# Altium schematic sheet USB_Connectors.SchDoc
size A3; PageSetup: Record=PageOptions|CenterHorizontal=True|CenterVertical=True|PrintScale=0.71|XCorrection=1.00|YCorrection=1.00|PrintKind=0|BorderSize=5000000|LeftOffset=0|BottomOffset=0|Orientation=2|PaperLength=1000|PaperWidth=1000|Scale=100|PaperSource=7|PrintQuality=-4|MediaType=1|DitherType=10|PaperKind=A4|PrintScaleMode=1; Date: 27.05.2014; DrawnBy: luths8; Organization: BFH; Address1: Bern University of Applied Sciences; Address2: Engineering and Information Technology; Address3: Jlcoweg 1; Address4: CH-3400 Burgdorf; DocumentNumber: 6; Revision: 1.1; SheetNumber: 6; SheetTotal: 16; CurrentDate: 27.05.2014
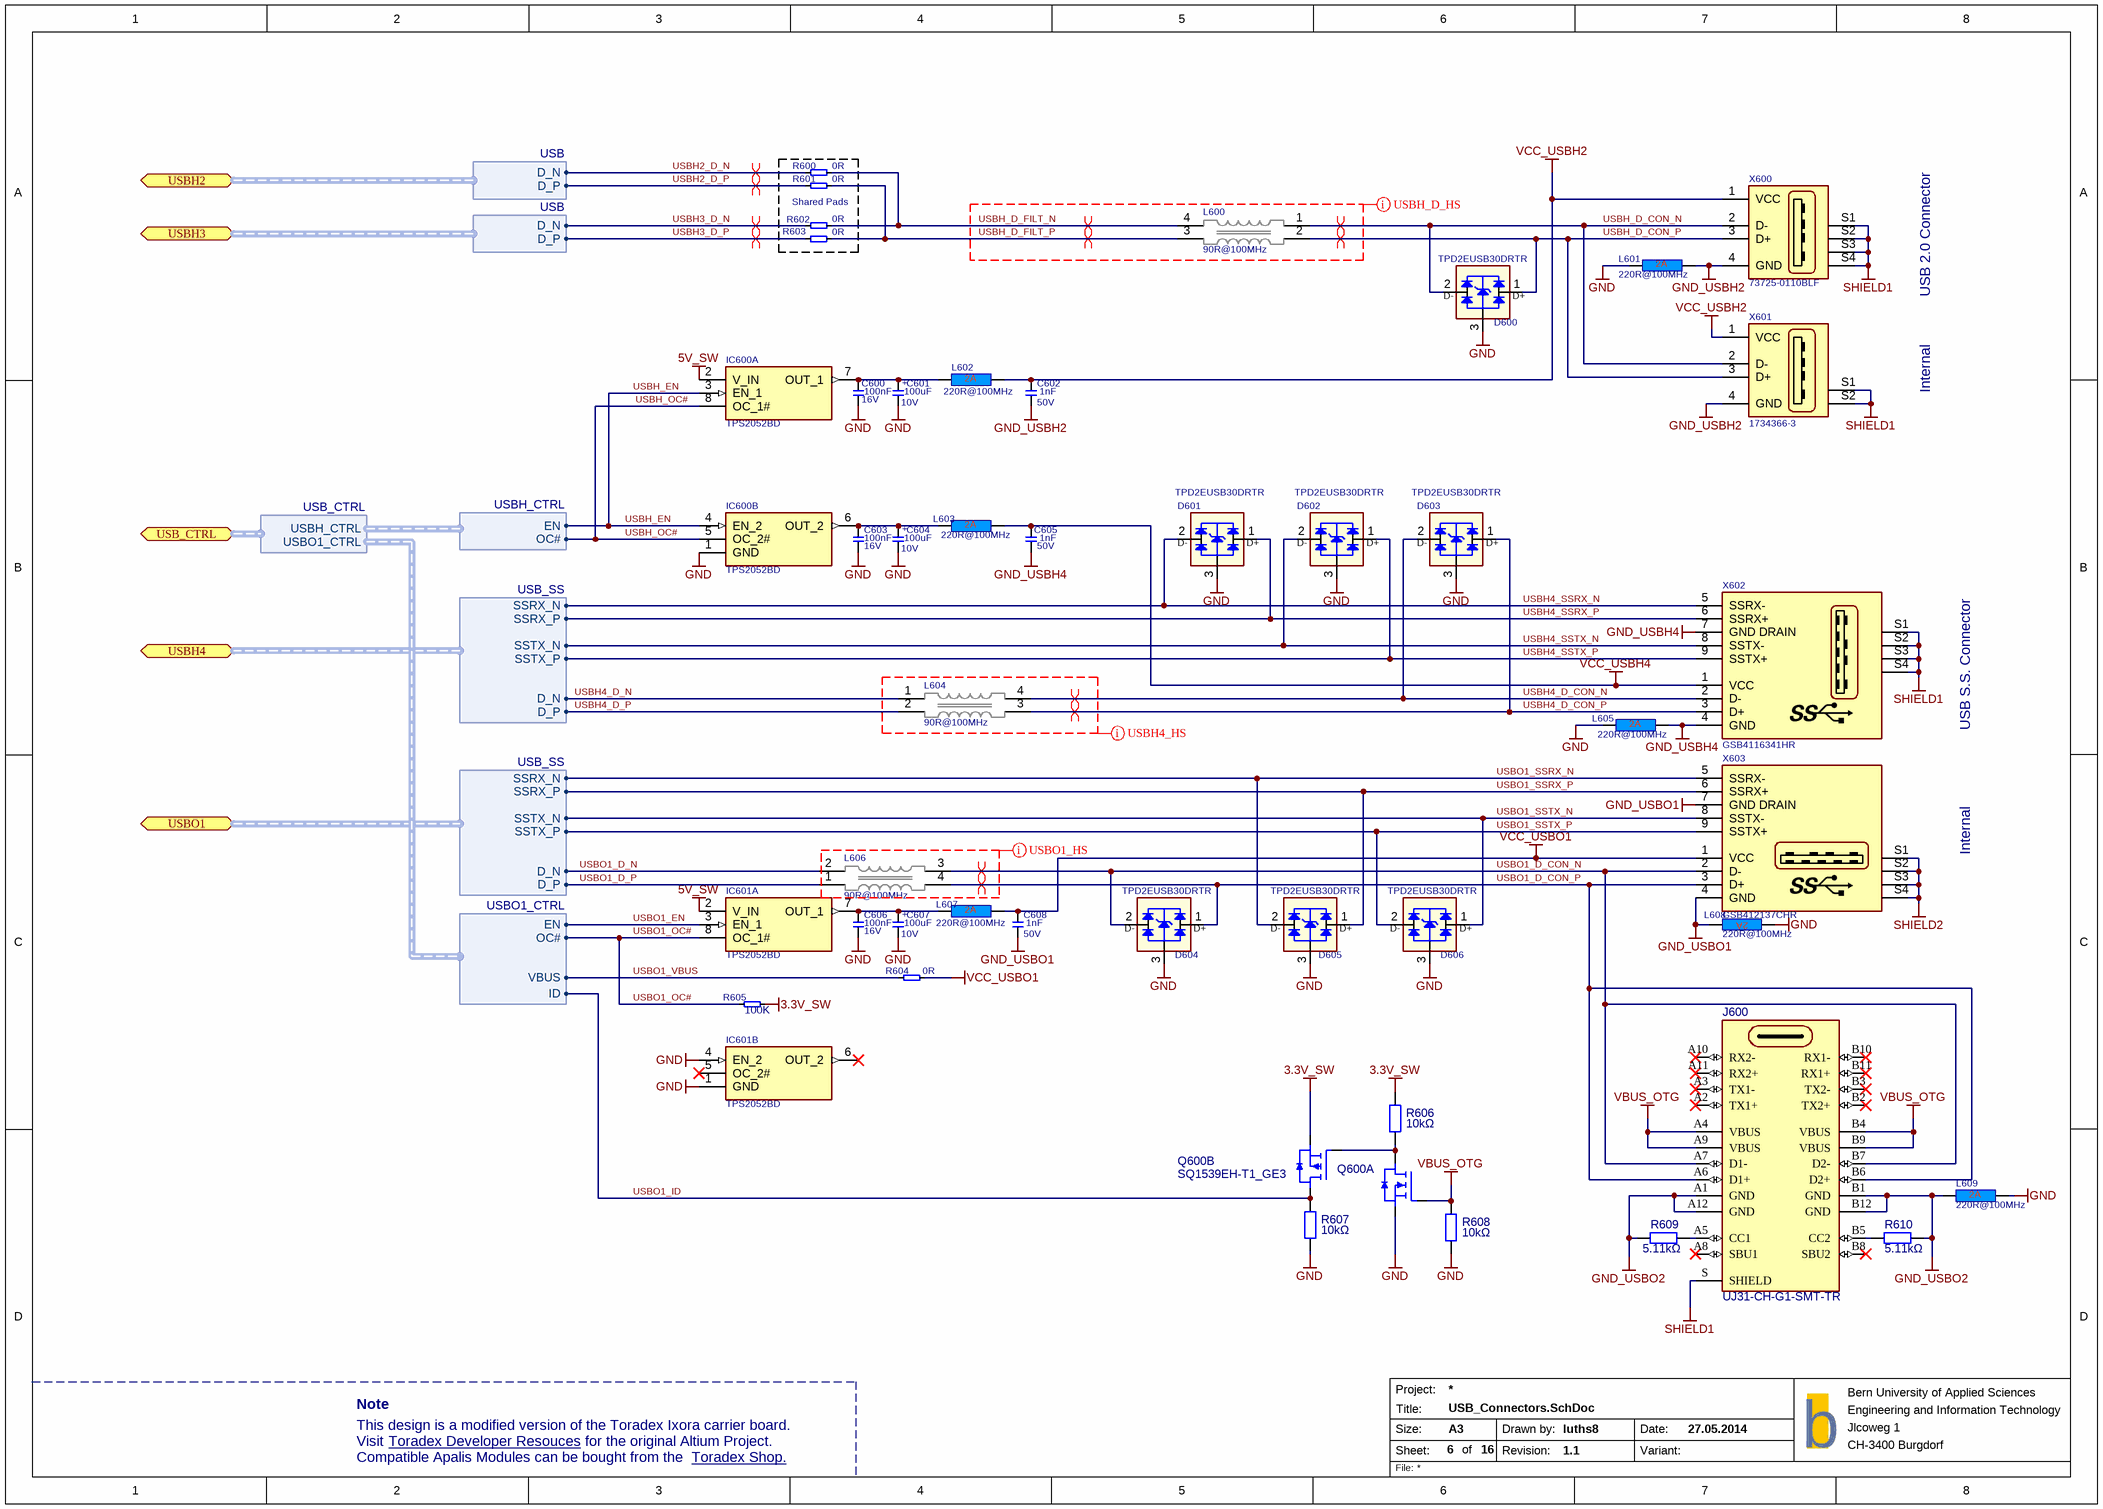
[diagram p0: USB_Connectors.SchDoc]

## Parts
C600  Rating: 16V  [SMD0603CAP]  (hidden comment: 100nF)
C601  Rating: 10V  [CAPMP6032X280N]  (hidden comment: 100uF)
C602  Rating: 50V  [SMD0603CAP]  (hidden comment: 1nF)
C603  Rating: 16V  [SMD0603CAP]  (hidden comment: 100nF)
C604  Rating: 10V  [CAPMP6032X280N]  (hidden comment: 100uF)
C605  Rating: 50V  [SMD0603CAP]  (hidden comment: 1nF)
C606  Rating: 16V  [SMD0603CAP]  (hidden comment: 100nF)
C607  Rating: 10V  [CAPMP6032X280N]  (hidden comment: 100uF)
C608  Rating: 50V  [SMD0603CAP]  (hidden comment: 1nF)
D600  TPD2EUSB30DRTR  [T_TI_TPD2EUSB30DRTR]
D601  TPD2EUSB30DRTR  [T_TI_TPD2EUSB30DRTR]
D602  TPD2EUSB30DRTR  [T_TI_TPD2EUSB30DRTR]
D603  TPD2EUSB30DRTR  [T_TI_TPD2EUSB30DRTR]
D604  TPD2EUSB30DRTR  [T_TI_TPD2EUSB30DRTR]
D605  TPD2EUSB30DRTR  [T_TI_TPD2EUSB30DRTR]
D606  TPD2EUSB30DRTR  [T_TI_TPD2EUSB30DRTR]
IC600  TPS2052BD  [SOIC127P600X173-8N]  (parts A,B of 2)
IC601  TPS2052BD  [SOIC127P600X173-8N]  (parts A,B of 2)
J600  UJ31-CH-G1-SMT-TR  [UJ31-CH-G1-SMT-TR]
L600  90R@100MHz  [T_Murata_DLW21SN900SQ2]
L601  220R@100MHz  [INDC1608X95N]
L602  220R@100MHz  [INDC1608X95N]
L603  220R@100MHz  [INDC1608X95N]
L604  90R@100MHz  [T_Murata_DLW21SN900SQ2]
L605  220R@100MHz  [INDC1608X95N]
L606  90R@100MHz  [T_Murata_DLW21SN900SQ2]
L607  220R@100MHz  [INDC1608X95N]
L608  220R@100MHz  [INDC1608X95N]
L609  220R@100MHz  [INDC1608X95N]
Q600  SQ1539EH-T1_GE3  [SOT-363-6]  (value not drawn)  (parts A,B of 2)
R600  0R  [SMD0603RES]
R601  0R  [SMD0603RES]
R602  0R  [SMD0603RES]
R603  0R  [SMD0603RES]
R604  0R  [SMD0603RES]
R605  100K  [SMD0603RES]
R606  10kΩ  [SMD0603RES]
R607  10kΩ  [SMD0603RES]
R608  10kΩ  [SMD0603RES]
R609  5.11kΩ  [SMD0603RES]
R610  5.11kΩ  [SMD0603RES]
X600  Manufacturer Part No.: 73725-0110BLF  [T_FCI_73725-0110BLF]  (hidden comment: CON-Fci-73725-0110BLF)
X601  CON-TE-1734366-3  [1734366-3]  (value not drawn)
X602  GSB4116341HR  [GSB4116341HR]
X603  GSB412137CHR  [GSB412137CHR]

## Blocks framed on the sheet
Shared Pads: R600-R603

## Ports
USB_CTRL (bidir, harness USB_CTRL), USBH2 (bidir, harness USB), USBH3 (bidir, harness USB), USBH4 (bidir, harness USB_SS), USBO1 (bidir, harness USB_SS)

## Harnesses
USB_SS: D_N, D_P, SSTX_N, SSTX_P, SSRX_N, SSRX_P
USBO1_CTRL: VBUS, ID, OC#, EN
USBH_CTRL: OC#, EN
USB_CTRL: USBO1_CTRL, USBH_CTRL
USB: D_N, D_P

## Nets
3.3V_SW: Q600.4(S) R605.2 R606.2
5V_SW: IC600.2(V_IN) IC601.2(V_IN)
GND: C600.1 C601.2 C603.1 C604.2 C606.1 C607.2 D600.3 D601.3 D602.3 D603.3 D604.3 D605.3 D606.3 IC600.1(GND) IC601.1(GND) IC601.4(EN_2) L601.1 L605.1 L608.1 L609.1 Q600.1(S) R607.1 R608.1
GND_USBH2: C602.1 L601.2 X600.4(GND) X601.4(GND)
GND_USBH4: C605.1 L605.2 X602.4(GND) X602.7(GND_DRAIN)
GND_USBO1: C608.1 L608.2 X603.4(GND) X603.7(GND_DRAIN)
GND_USBO2: J600.A1(GND) J600.A12(GND) J600.B1(GND) J600.B12(GND) L609.2 R609.1 R610.1
SHIELD1: J600.S(SHIELD) X600.S1 X600.S2 X600.S3 X600.S4 X601.S1 X601.S2 X602.S1 X602.S2 X602.S3 X602.S4
SHIELD2: X603.S1 X603.S2 X603.S3 X603.S4
VBUS_OTG: J600.A4(VBUS) J600.A9(VBUS) J600.B4(VBUS) J600.B9(VBUS) Q600.2(G) R608.2
VCC_USBH2: C602.2 L602.2 X600.1(VCC) X601.1(VCC)
VCC_USBH4: C605.2 L603.2 X602.1(VCC)
VCC_USBO1: C608.2 L607.2 R604.2 X603.1(VCC)
USBH2_D_N: R600.1 ; port USBH2.D_N
USBH2_D_P: R601.1 ; port USBH2.D_P
USBH3_D_N: R602.1 ; port USBH3.D_N
USBH3_D_P: R603.1 ; port USBH3.D_P
USBH4_D_CON_N: D603.2(D-) L604.4 X602.2(D-)
USBH4_D_CON_P: D603.1(D+) L604.3 X602.3(D+)
USBH4_D_N: L604.1 ; port USBH4.D_N
USBH4_D_P: L604.2 ; port USBH4.D_P
USBH4_SSRX_N: D601.2(D-) X602.5(SSRX-) ; port USBH4.SSRX_N
USBH4_SSRX_P: D601.1(D+) X602.6(SSRX+) ; port USBH4.SSRX_P
USBH4_SSTX_N: D602.2(D-) X602.8(SSTX-) ; port USBH4.SSTX_N
USBH4_SSTX_P: D602.1(D+) X602.9(SSTX+) ; port USBH4.SSTX_P
USBH_D_CON_N: D600.2(D-) L600.1 X600.2(D-) X601.2(D-)
USBH_D_CON_P: D600.1(D+) L600.2 X600.3(D+) X601.3(D+)
USBH_D_FILT_N: L600.4 R600.2 R602.2
USBH_D_FILT_P: L600.3 R601.2 R603.2
USBH_EN: IC600.3(EN_1) IC600.4(EN_2) ; harness USBH_CTRL.EN
USBH_OC#: IC600.5(OC_2#) IC600.8(OC_1#) ; harness USBH_CTRL.OC#
USBO1_D_CON_N: D604.2(D-) J600.A7(D1-) J600.B7(D2-) L606.3 X603.2(D-)
USBO1_D_CON_P: D604.1(D+) J600.A6(D1+) J600.B6(D2+) L606.4 X603.3(D+)
USBO1_D_N: L606.2 ; port USBO1.D_N
USBO1_D_P: L606.1 ; port USBO1.D_P
USBO1_EN: IC601.3(EN_1) ; harness USBO1_CTRL.EN
USBO1_ID: Q600.3(D) R607.2 ; harness USBO1_CTRL.ID
USBO1_OC#: IC601.8(OC_1#) R605.1 ; harness USBO1_CTRL.OC#
USBO1_SSRX_N: D605.2(D-) X603.5(SSRX-) ; port USBO1.SSRX_N
USBO1_SSRX_P: D605.1(D+) X603.6(SSRX+) ; port USBO1.SSRX_P
USBO1_SSTX_N: D606.1(D+) X603.8(SSTX-) ; port USBO1.SSTX_N
USBO1_SSTX_P: D606.2(D-) X603.9(SSTX+) ; port USBO1.SSTX_P
USBO1_VBUS: R604.1 ; harness USBO1_CTRL.VBUS
NetC600_2: C600.2 C601.1 IC600.7(OUT_1) L602.1
NetC603_2: C603.2 C604.1 IC600.6(OUT_2) L603.1
NetC606_2: C606.2 C607.1 IC601.7(OUT_1) L607.1
NetJ600_A5: J600.A5(CC1) R609.2
NetJ600_B5: J600.B5(CC2) R610.2
NetQ600_5: Q600.5(G) Q600.6(D) R606.1

Not connected (* = marked no-connect by the designer): IC601 5(OC_2#)* 6(OUT_2)*; J600 A2(TX1+)* A3(TX1-)* A8(SBU1)* A10(RX2-)* A11(RX2+)* B2(TX2+)* B3(TX2-)* B8(SBU2)* B10(RX1-)* B11(RX1+)*

## Layout directives
differential pair: USBH2_D_N, USBH2_D_P, USBH3_D_N, USBH3_D_P, USBH4_D_CON_N, USBH4_D_CON_P, USBH_D_CON_N, USBH_D_CON_P, USBH_D_FILT_N, USBH_D_FILT_P, USBO1_D_CON_N, USBO1_D_CON_P
net class USBO1_HS: (no net found under the mark)
net class USBH4_HS: (no net found under the mark)
net class USBH_D_HS: USBH_D_FILT_N, USBH_D_FILT_P

## Notes on the sheet
- USB 2.0 Connector
- Internal
- USB S.S. Connector
- Note
- This design is a modified version of the Toradex Ixora carrier board.
- Visit
- Compatible Apalis Modules can be bought from the
- Toradex Developer Resouces <https://developer.toradex.com/products/ixora-carrier-board>
- for the original Altium Project.
- Toradex Shop. <https://www.toradex.com/order-now/apalis-arm-family>
- Project:
- Size:
- Sheet:
- Title:
- A3
- of
- Drawn by:
- Revision:
- Date:
- Variant:
- b
- File:
- (in symbol C-TA-100uF-10V-10%-6032) +

## Library data of the parts
C600 C603 C606 = C-X7R-100nF-16V-10%-0402: Capacitor Ceramic X7R 100nF 16V 10% 0603; Tolerance: 10%; Type: X7R; Value: 100nF
C601 C604 C607 = C-TA-100uF-10V-10%-6032: Capacitor TA 100uF 10V 10% 6032; Tolerance: 10%; Type: TA; Value: 100uF
C602 C605 C608 = C-X7R-1nF-50V-10%-0402: Capacitor Ceramic X7R 1nF 50V 10% 0603; Tolerance: 10%; Type: X7R; Value: 1nF
D600-D606 = D-TI-TPD2EUSB30DRTR: 2 Channel Protection for Super Speed USB3.0; Manufacturer Name: TI; Manufacturer Part No.: TPD2EUSB30DRTR
IC600 IC601 = IC-TI-TPS2052BD: Dual High Side Switch With OC_DET 500mA/CH; Manufacturer Name: Texas Instruments; Manufacturer Part No.: TPS2052BD
J600 = Connector USB C: USB Type C Jack; Manufacturer Part No.: UJ31-CH-G1-SMT-TR
L600 L604 L606 = L-Murata-DLW21SN900SQ2-90R@100MHz-330mA-25%: Common Mode Choke High Speed 90R 330mA; Manufacturer Name: Murata; Tolerance: 25%; Rating: 330mA; Manufacturer Part No.: DLW21SN900SQ2; Value: 90R@100MHz
L601-L603 L605 L607-L609 = L-220R@100MHz-2A-25%-0603: 220R@100MHz 2A EMI FILTER; Tolerance: 25%; Rating: 2A; Value: 220R@100MHz
Q600 = Transistor N/PMOS Dual: Transistor Dual, NMOS & PMOS; Manufacturer Part No.: SQ1539EH-T1_GE3
R600-R603 = R-0R-63mW-1%-0603: Resistor 0 ohm 63mW 1% 0603; Rating: 63mW; Tolerance: 1%; Value: 0R
R604 = R-0R-63mW-1%-0402: Resistor 0 ohm 63mW 1% 0603; Rating: 63mW; Tolerance: 1%; Value: 0R
R605 = R-100KR-63mW-5%-0402: Resistor 100 Kohm 63mW 5% 0603; Value: 100KR; Rating: 63mW; Tolerance: 5%
R606-R610 = Resistor
X600 = CON-Fci-73725-0110BLF: USB Type A Connector; Manufacturer Name: FCI; No. of ways: 4; System: Connector
X601 = CON-TE-1734366-3: USB Type A Connector Vertical; Manufacturer Name: TE; Manufacturer Part No.: 1734366-3; System: Connector
X602 = CON-Amphenol-GSB4116341HR: USB 3.1, Type A, sideways; System: Connector; Manufacturer Name: Amphenol; Manufacturer Part No.: GSB4116341HR
X603 = CON-Amphenol-GSB412137CHR: USB 3.1, Type A, vertical; System: Connector; Manufacturer Name: Amphenol; Manufacturer Part No.: GSB412137CHR